# EAGLE schematic 8Bit-audio-7524-axelb-v2 (EAGLE 9.6.2)
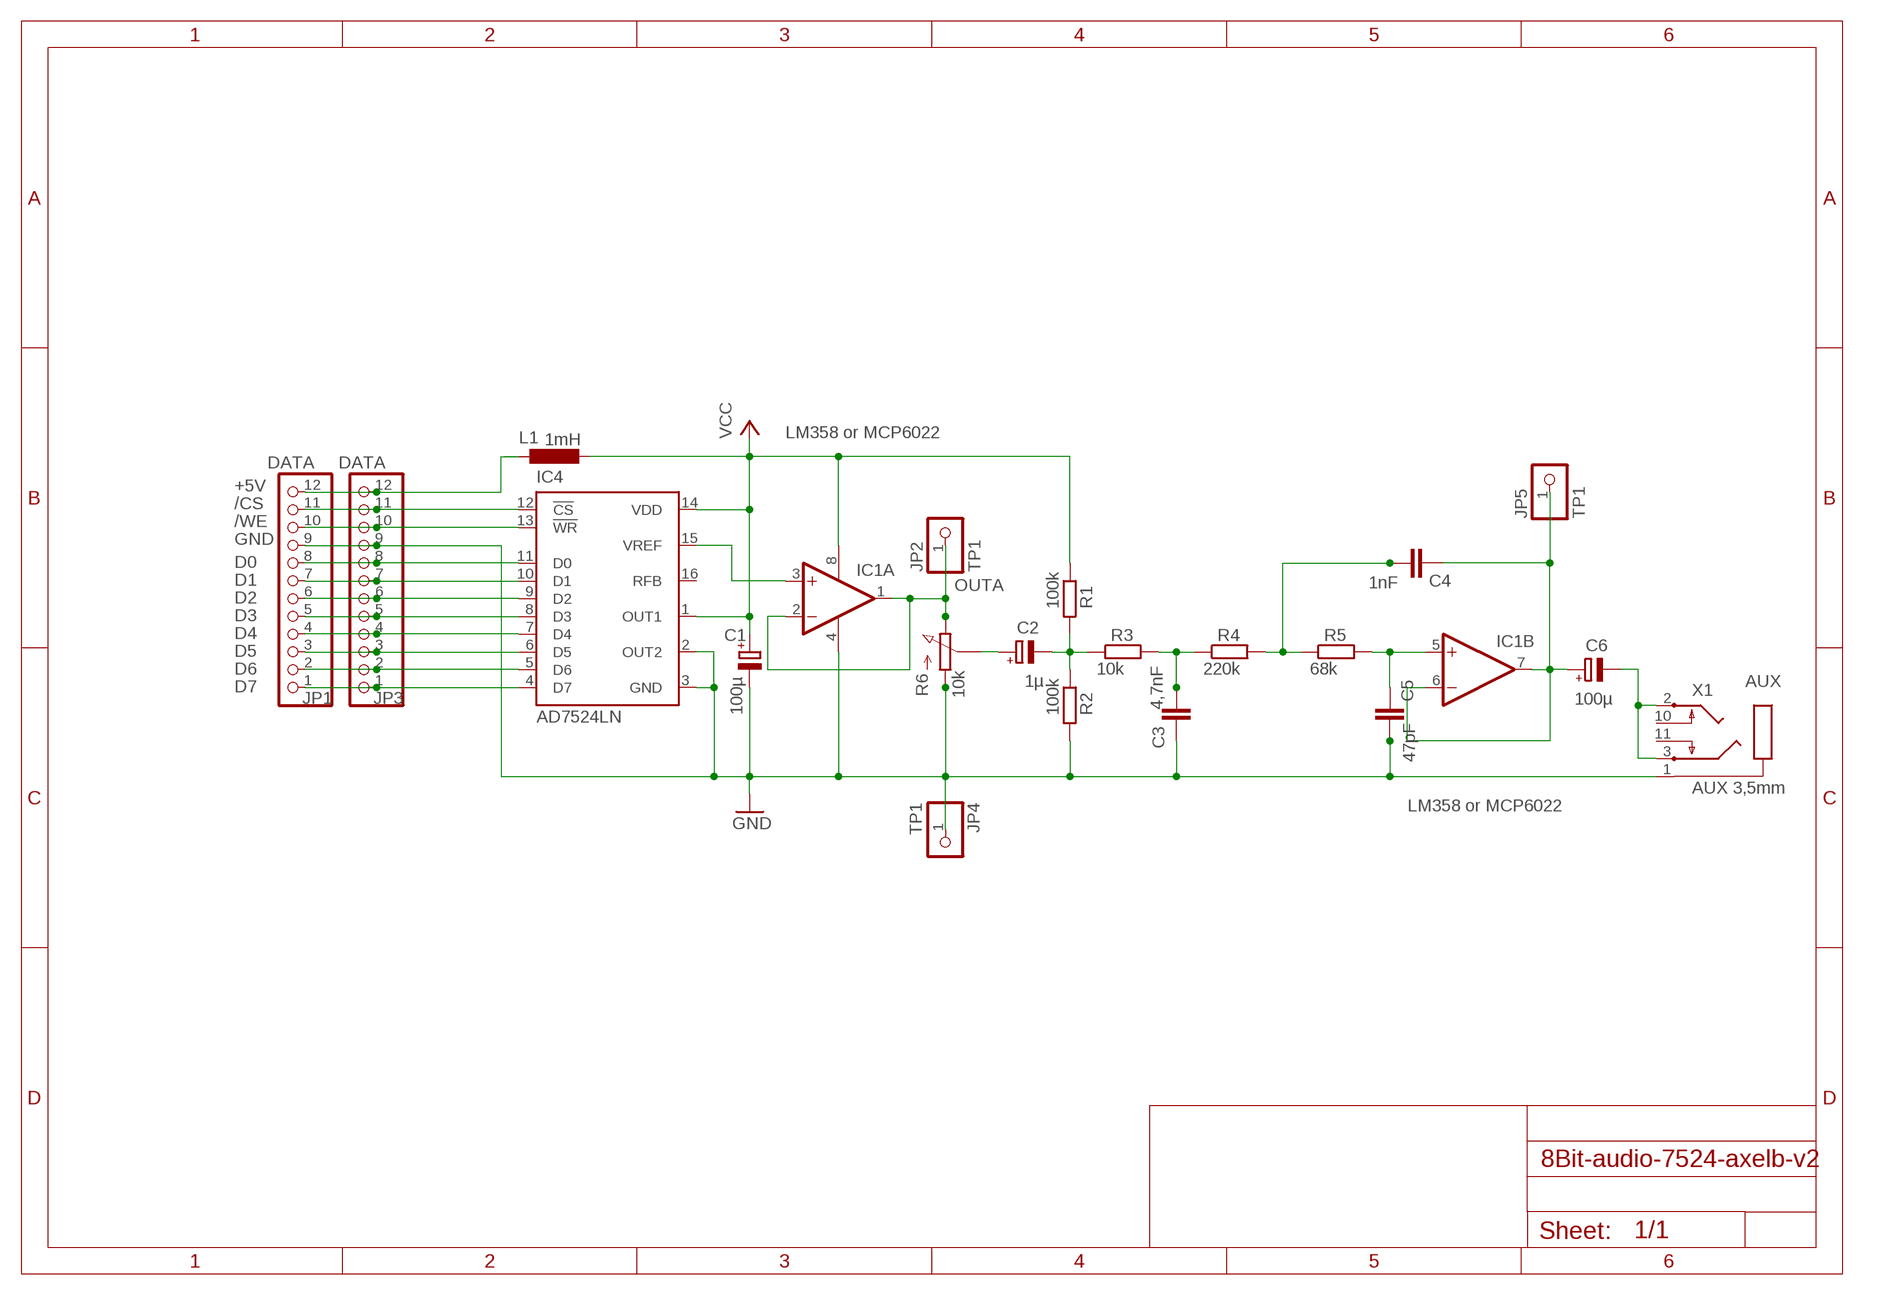
[diagram p0: schematic, sheet 1]

## Parts
C1  100µ  CPOL-EUE5-5  [E5-5]
C2  1µ  CPOL-EUE5-5  [E5-5]
C3  4,7nF  RCL_C-EU025_050-055X075  [RCL_C025_050-055X075]
C4  1nF  RCL_C-EU025_050-055X075  [RCL_C025_050-055X075]
C5  47pF  RCL_C-EU025_050-055X075  [RCL_C025_050-055X075]
C6  100µ  CPOL-EUE5-5  [E5-5]
IC1  LM358 or MCP6022  LM358N  [DIL08]
IC4  AD7524LN  [DIL16]
JP1  DATA  PINHD-1X12  [1X12]
JP2  TP1  PINHD-1X1  [1X01]
JP3  DATA  PINHD-1X12  [1X12]
JP4  TP1  PINHD-1X1  [1X01]
JP5  TP1  PINHD-1X1  [1X01]
L1  1mH  L-EU0207/10  [0207/10]
R1  100k  R-EU_0207/10  [0207/10]
R2  100k  R-EU_0207/10  [0207/10]
R3  10k  R-EU_0207/10  [0207/10]
R4  220k  R-EU_0207/10  [0207/10]
R5  68k  R-EU_0207/10  [0207/10]
R6  10k  POT_3RP/1610N  [POT_3RP/1610N]
X1  AUX 3,5mm  CON-SJ1-352XNSJ1-352XN  [SJ1-352XN]

## Nets
+5V: JP1.12 JP3.12 L1.1
/CS: IC4.12(!CS) JP1.11 JP3.11
/WE: IC4.13(!WR) JP1.10 JP3.10
AUX: C6.- X1.2 X1.3
D0: IC4.11(D0) JP1.8 JP3.8
D1: IC4.10(D1) JP1.7 JP3.7
D2: IC4.9(D2) JP1.6 JP3.6
D3: IC4.8(D3) JP1.5 JP3.5
D4: IC4.7(D4) JP1.4 JP3.4
D5: IC4.6(D5) JP1.3 JP3.3
D6: IC4.5(D6) JP1.2 JP3.2
D7: IC4.4(D7) JP1.1 JP3.1
GND: C1.- C3.1(A1) C5.2(B1) C5.3(B2) IC1.4(P:V-) IC4.2(OUT2) IC4.3(GND) JP1.9 JP3.9 JP4.1 R2.2 R6.A1 R6.A2 X1.1
N$1: IC1.3(A:+IN) IC4.15(VREF)
N$3: C2.- R1.2 R2.1 R3.1
N$5: C2.+ R6.M(S)
N$6: C3.2(B1) C3.3(B2) R3.2 R4.1
N$7: C4.2(B1) C4.3(B2) R4.2 R5.1
N$9: C5.1(A1) IC1.5(B:+IN) R5.2
OUTA: IC1.1(A:OUT) IC1.2(A:-IN) JP2.1 R6.E1 R6.E2
OUTB: C4.1(A1) C6.+ IC1.6(B:-IN) IC1.7(B:OUT) JP5.1
VCC: C1.+ IC1.8(P:V+) IC4.1(OUT1) IC4.14(VDD) L1.2 R1.1
Unconnected: IC4.16(RFB) X1.10 X1.11

## Library data of the parts
C1 C2 C6 = rcl:CPOL-EU: POLARIZED CAPACITOR, European symbol; SPICEPREFIX: C
C3-C5 = myLbr:RCL_C-EU: CAPACITOR, European symbol; SPICEPREFIX: C
IC1 = linear:LM358: OP AMP also LM158; LM258; LM2904 Source: http://cache.national.com/ds/LM/LM158.pdf
IC4 = analog-devices:AD7524*: 8-Bit Buffered Multiplying DAC Source: http://www.analog.com/UploadedFiles/Data_Sheets/888358036ad7524.pdf; MF: ALTERA CORPORATION; MPN: AD7524LNZ; OC_FARNELL: 9605401; OC_NEWARK: 59K4974
JP1 JP3 = pinhead:PINHD-1X12: PIN HEADER
JP2 JP4 JP5 = pinhead:PINHD-1X1: PIN HEADER
L1 = rcl:L-EU: INDUCTOR, European symbol; SPICEPREFIX: L
R1-R5 = rcl:R-EU_: RESISTOR, European symbol; SPICEPREFIX: R
R6 = myLbr:POT_3RP/1610N: 16mm Potentiometer one level Source: http://www.alphapotentiometers.net/html/16mm_pot_2.html
X1 = CON SJ1-352XN:CON-SJ1-352XN: MIC/HEADPHONE JACK KS-S stereo microphone/headphone jack SJ1-352XN (CUD Devices)